# Altium schematic sheet SRAM.SchDoc
size A4; SheetNumber: 8; SheetTotal: 8
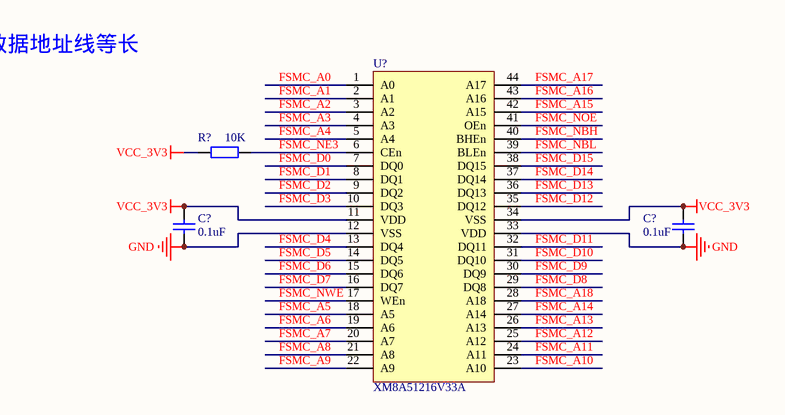
[diagram p0: SRAM.SchDoc]

## Parts
(Parts that share a designator on the sheet are numbered #1, #2 ... from top to bottom, then left to right.)
C?#1  0.1uF  [C0402_L]
C?#2  0.1uF  [C0402_L]
R?  10K  [R0402_L]
U?  XM8A51216V33A  [TSOP II(44Pin)]

## Nets
GND: C?#1.1 C?#2.1 U?.12(VSS) U?.33(VDD)
VCC_3V3: C?#1.2 C?#2.2 R?.1 U?.11(VDD) U?.34(VSS)
FSMC_A0: U?.1(A0)
FSMC_A1: U?.2(A1)
FSMC_A2: U?.3(A2)
FSMC_A3: U?.4(A3)
FSMC_A4: U?.5(A4)
FSMC_A5: U?.18(A5)
FSMC_A6: U?.19(A6)
FSMC_A7: U?.20(A7)
FSMC_A8: U?.21(A8)
FSMC_A9: U?.22(A9)
FSMC_A10: U?.23(A10)
FSMC_A11: U?.24(A11)
FSMC_A12: U?.25(A12)
FSMC_A13: U?.26(A13)
FSMC_A14: U?.27(A14)
FSMC_A15: U?.42(A15)
FSMC_A16: U?.43(A16)
FSMC_A17: U?.44(A17)
FSMC_A18: U?.28(A18)
FSMC_D0: U?.7(DQ0)
FSMC_D1: U?.8(DQ1)
FSMC_D2: U?.9(DQ2)
FSMC_D3: U?.10(DQ3)
FSMC_D4: U?.13(DQ4)
FSMC_D5: U?.14(DQ5)
FSMC_D6: U?.15(DQ6)
FSMC_D7: U?.16(DQ7)
FSMC_D8: U?.29(DQ8)
FSMC_D9: U?.30(DQ9)
FSMC_D10: U?.31(DQ10)
FSMC_D11: U?.32(DQ11)
FSMC_D12: U?.35(DQ12)
FSMC_D13: U?.36(DQ13)
FSMC_D14: U?.37(DQ14)
FSMC_D15: U?.38(DQ15)
FSMC_NBH: U?.40(BHEn)
FSMC_NBL: U?.39(BLEn)
FSMC_NE3: R?.2 U?.6(CEn)
FSMC_NOE: U?.41(OEn)
FSMC_NWE: U?.17(WEn)

## Notes on the sheet
- 数据地址线等长

## Library data of the parts
C?#1 C?#2 = C: 贴片电容; BOM名称: 无极性贴片电容; 联系卖家，免费查找封装: 唯一出售店铺网址https://shop463601444.taobao.com
R? = R: 贴片电阻; 联系卖家，免费查找封装: 唯一出售店铺网址https://shop463601444.taobao.com; BOM名称: 贴片电阻
U? = XM8A51216V33A: 8Mb SRAM 10ns/12ns/15ns